# Altium schematic sheet sensor_flexconn.SchDoc: Magic Baton: Sensor Flex Connector
size Letter
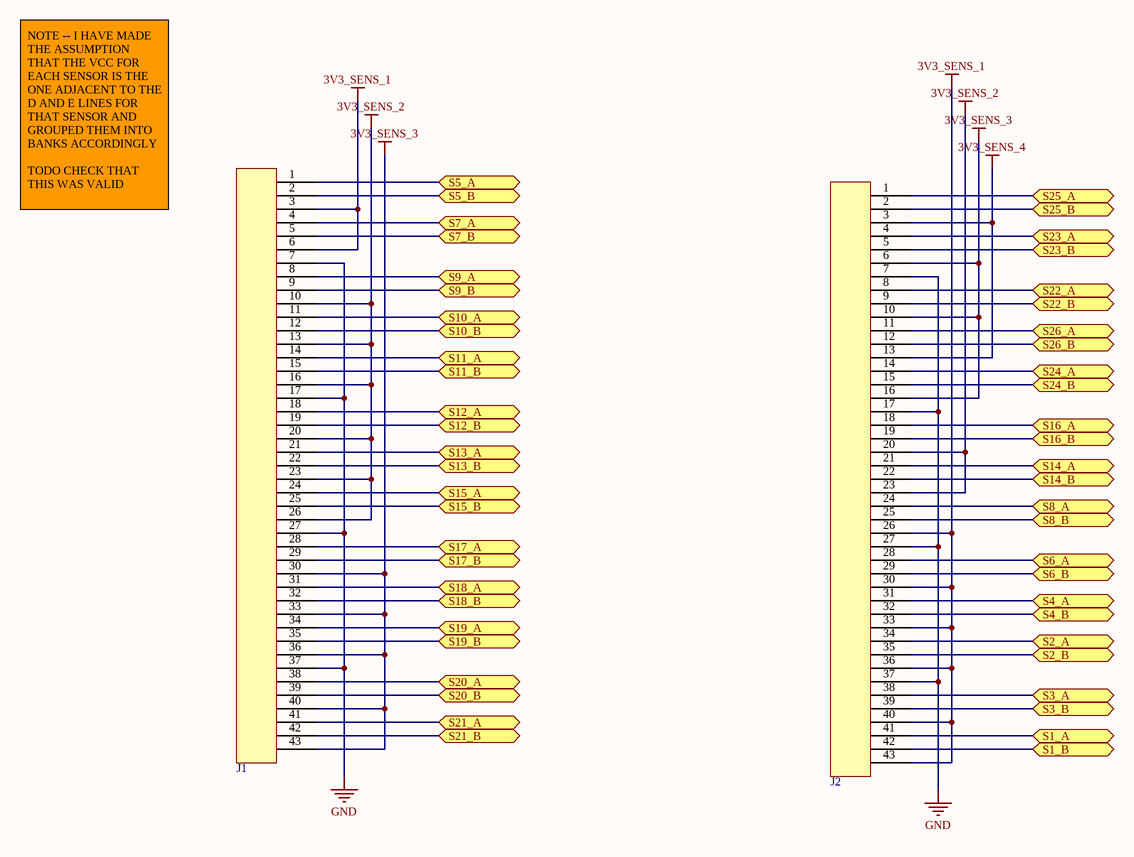
[diagram p0: sensor_flexconn.SchDoc]

## Parts
J1  503566-4302  (value not drawn)
J2  503566-4302  (value not drawn)

## Ports
S1_A (bidir), S1_B (bidir), S2_A (bidir), S2_B (bidir), S3_A (bidir), S3_B (bidir), S4_A (bidir), S4_B (bidir), S5_A (bidir), S5_B (bidir), S6_A (bidir), S6_B (bidir), S7_A (bidir), S7_B (bidir), S8_A (bidir), S8_B (bidir), S9_A (bidir), S9_B (bidir), S10_A (bidir), S10_B (bidir), S11_A (bidir), S11_B (bidir), S12_A (bidir), S12_B (bidir), S13_A (bidir), S13_B (bidir), S14_A (bidir), S14_B (bidir), S15_A (bidir), S15_B (bidir), S16_A (bidir), S16_B (bidir), S17_A (bidir), S17_B (bidir), S18_A (bidir), S18_B (bidir), S19_A (bidir), S19_B (bidir), S20_A (bidir), S20_B (bidir), S21_A (bidir), S21_B (bidir), S22_A (bidir), S22_B (bidir), S23_A (bidir), S23_B (bidir), S24_A (bidir), S24_B (bidir), S25_A (bidir), S25_B (bidir), S26_A (bidir), S26_B (bidir)

## Nets
3V3_SENS_1: J1.3 J1.6 J2.26 J2.30 J2.33 J2.36 J2.40 J2.43
3V3_SENS_2: J1.10 J1.13 J1.16 J1.20 J1.23 J1.26 J2.20 J2.23
3V3_SENS_3: J1.30 J1.33 J1.36 J1.40 J1.43 J2.6 J2.10 J2.16
3V3_SENS_4: J2.3 J2.13
GND: J1.7 J1.17 J1.27 J1.37 J2.7 J2.17 J2.27 J2.37
S1_A: J2.41 ; port S1_A
S1_B: J2.42 ; port S1_B
S2_A: J2.34 ; port S2_A
S2_B: J2.35 ; port S2_B
S3_A: J2.38 ; port S3_A
S3_B: J2.39 ; port S3_B
S4_A: J2.31 ; port S4_A
S4_B: J2.32 ; port S4_B
S5_A: J1.1 ; port S5_A
S5_B: J1.2 ; port S5_B
S6_A: J2.28 ; port S6_A
S6_B: J2.29 ; port S6_B
S7_A: J1.4 ; port S7_A
S7_B: J1.5 ; port S7_B
S8_A: J2.24 ; port S8_A
S8_B: J2.25 ; port S8_B
S9_A: J1.8 ; port S9_A
S9_B: J1.9 ; port S9_B
S10_A: J1.11 ; port S10_A
S10_B: J1.12 ; port S10_B
S11_A: J1.14 ; port S11_A
S11_B: J1.15 ; port S11_B
S12_A: J1.18 ; port S12_A
S12_B: J1.19 ; port S12_B
S13_A: J1.21 ; port S13_A
S13_B: J1.22 ; port S13_B
S14_A: J2.21 ; port S14_A
S14_B: J2.22 ; port S14_B
S15_A: J1.24 ; port S15_A
S15_B: J1.25 ; port S15_B
S16_A: J2.18 ; port S16_A
S16_B: J2.19 ; port S16_B
S17_A: J1.28 ; port S17_A
S17_B: J1.29 ; port S17_B
S18_A: J1.31 ; port S18_A
S18_B: J1.32 ; port S18_B
S19_A: J1.34 ; port S19_A
S19_B: J1.35 ; port S19_B
S20_A: J1.38 ; port S20_A
S20_B: J1.39 ; port S20_B
S21_A: J1.41 ; port S21_A
S21_B: J1.42 ; port S21_B
S22_A: J2.8 ; port S22_A
S22_B: J2.9 ; port S22_B
S23_A: J2.4 ; port S23_A
S23_B: J2.5 ; port S23_B
S24_A: J2.14 ; port S24_A
S24_B: J2.15 ; port S24_B
S25_A: J2.1 ; port S25_A
S25_B: J2.2 ; port S25_B
S26_A: J2.11 ; port S26_A
S26_B: J2.12 ; port S26_B

## Notes on the sheet
- NOTE -- I HAVE MADE THE ASSUMPTION THAT THE VCC FOR EACH SENSOR IS THE ONE ADJACENT TO THE D AND E LINES FOR THAT SENSOR AND GROUPED THEM INTO BANKS ACCORDINGLY
  TODO CHECK THAT THIS WAS VALID
- Title
- Size:
- Date:
- Letter
- Number:
- Time:
- Revision:
- Sheet
- of
- File:

## Library data of the parts
J1 J2 = 503566-4302: FPC Connector, 43P, 0.3mm